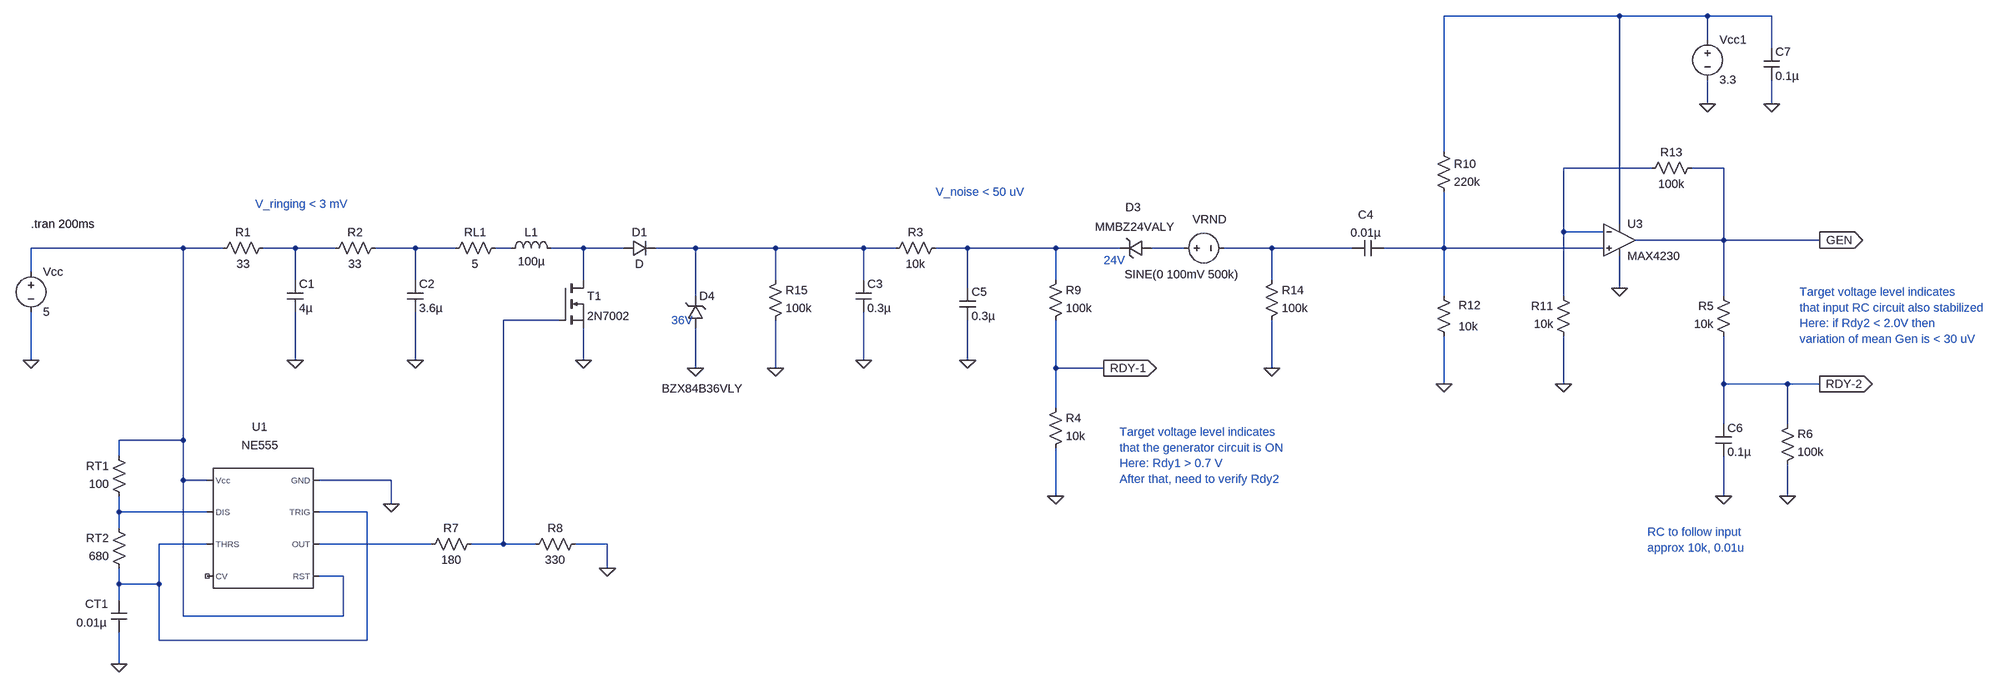
[diagram p0: schematic BoostPump10_WaveExtractor_red.asc]
BoostPump10_WaveExtractor_red.asc, the LTspice schematic file:
Version 4
SHEET 1 4340 772
WIRE 2576 -544 2160 -544
WIRE 2752 -544 2576 -544
WIRE 2880 -544 2752 -544
WIRE 2752 -496 2752 -544
WIRE 2880 -480 2880 -544
WIRE 2752 -368 2752 -416
WIRE 2880 -368 2880 -416
WIRE 2160 -272 2160 -544
WIRE 2640 -240 2464 -240
WIRE 2784 -240 2720 -240
WIRE 2576 -128 2576 -544
WIRE 2464 -112 2464 -240
WIRE 2544 -112 2464 -112
WIRE 2784 -96 2784 -240
WIRE 2784 -96 2608 -96
WIRE 2976 -96 2784 -96
WIRE -400 -80 -704 -80
WIRE -320 -80 -400 -80
WIRE -176 -80 -240 -80
WIRE -96 -80 -176 -80
WIRE 64 -80 -16 -80
WIRE 144 -80 64 -80
WIRE 256 -80 224 -80
WIRE 400 -80 336 -80
WIRE 480 -80 400 -80
WIRE 624 -80 544 -80
WIRE 784 -80 624 -80
WIRE 960 -80 784 -80
WIRE 1024 -80 960 -80
WIRE 1168 -80 1104 -80
WIRE 1344 -80 1168 -80
WIRE 1472 -80 1344 -80
WIRE 1600 -80 1536 -80
WIRE 1776 -80 1680 -80
WIRE 1936 -80 1776 -80
WIRE 2160 -80 2160 -192
WIRE 2160 -80 2000 -80
WIRE 2544 -80 2160 -80
WIRE -704 -32 -704 -80
WIRE -176 -16 -176 -80
WIRE 64 -16 64 -80
WIRE 400 -16 400 -80
WIRE 784 -16 784 -80
WIRE 960 -16 960 -80
WIRE 1344 -16 1344 -80
WIRE 1776 -16 1776 -80
WIRE 1168 0 1168 -80
WIRE 2576 0 2576 -64
WIRE 624 16 624 -80
WIRE 2160 16 2160 -80
WIRE 2464 16 2464 -112
WIRE 2784 16 2784 -96
WIRE 352 64 240 64
WIRE -704 144 -704 48
WIRE -176 144 -176 48
WIRE 64 144 64 48
WIRE 400 144 400 80
WIRE 960 144 960 48
WIRE 1168 144 1168 64
WIRE 624 160 624 80
WIRE 784 160 784 64
WIRE 1344 160 1344 64
WIRE 1440 160 1344 160
WIRE 1776 160 1776 64
WIRE 2160 192 2160 96
WIRE 2464 192 2464 96
WIRE 2784 192 2784 96
WIRE 2912 192 2784 192
WIRE 2976 192 2912 192
WIRE 1344 240 1344 160
WIRE 2784 272 2784 192
WIRE 2912 272 2912 192
WIRE -400 304 -400 -80
WIRE -400 304 -528 304
WIRE -528 336 -528 304
WIRE -400 384 -400 304
WIRE -352 384 -400 384
WIRE 16 384 -128 384
WIRE 1344 416 1344 320
WIRE 2784 416 2784 336
WIRE 2912 416 2912 352
WIRE 16 432 16 384
WIRE -528 448 -528 416
WIRE -352 448 -528 448
WIRE -32 448 -128 448
WIRE -528 480 -528 448
WIRE -352 512 -448 512
WIRE 96 512 -128 512
WIRE 240 512 240 64
WIRE 240 512 176 512
WIRE 304 512 240 512
WIRE 448 512 384 512
WIRE 448 560 448 512
WIRE -80 576 -128 576
WIRE -528 592 -528 560
WIRE -448 592 -448 512
WIRE -448 592 -528 592
WIRE -528 624 -528 592
WIRE -400 656 -400 384
WIRE -80 656 -80 576
WIRE -80 656 -400 656
WIRE -448 704 -448 592
WIRE -32 704 -32 448
WIRE -32 704 -448 704
WIRE -528 752 -528 688
FLAG 64 144 0
FLAG 400 144 0
FLAG 960 144 0
FLAG -704 144 0
FLAG 624 160 0
FLAG 1168 144 0
FLAG -176 144 0
FLAG -528 752 0
FLAG 16 432 0
FLAG 448 560 0
FLAG 2576 0 0
FLAG 2752 -368 0
FLAG 2880 -368 0
FLAG 2976 -96 GEN
IOPIN 2976 -96 Out
FLAG 1344 416 0
FLAG 1440 160 RDY-1
IOPIN 1440 160 Out
FLAG 2464 192 0
FLAG 2160 192 0
FLAG 2784 416 0
FLAG 784 160 0
FLAG 2912 416 0
FLAG 2976 192 RDY-2
IOPIN 2976 192 Out
FLAG 1776 160 0
SYMBOL res 0 -96 R90
WINDOW 0 0 56 VBottom 2
WINDOW 3 32 56 VTop 2
SYMATTR InstName R2
SYMATTR Value 33
SYMBOL res 240 -96 R90
WINDOW 0 0 56 VBottom 2
WINDOW 3 32 56 VTop 2
SYMATTR InstName RL1
SYMATTR Value 5
SYMBOL cap 48 -16 R0
SYMATTR InstName C2
SYMATTR Value 3.6µ
SYMBOL cap 944 -16 R0
SYMATTR InstName C3
SYMATTR Value 0.3µ
SYMBOL ind 240 -64 R270
WINDOW 0 32 56 VTop 2
WINDOW 3 5 56 VBottom 2
SYMATTR InstName L1
SYMATTR Value 100µ
SYMBOL diode 480 -64 R270
WINDOW 0 32 32 VTop 2
WINDOW 3 0 32 VBottom 2
SYMATTR InstName D1
SYMBOL nmos 352 -16 R0
SYMATTR InstName T1
SYMATTR Value 2N7002
SYMBOL voltage -704 -48 R0
WINDOW 123 0 0 Left 0
WINDOW 39 0 0 Left 0
SYMATTR InstName Vcc
SYMATTR Value 5
SYMBOL res 1120 -96 R90
WINDOW 0 0 56 VBottom 2
WINDOW 3 32 56 VTop 2
SYMATTR InstName R3
SYMATTR Value 10k
SYMBOL zener 1536 -96 R90
WINDOW 0 -50 37 VBottom 2
WINDOW 3 -42 34 VTop 2
SYMATTR InstName D3
SYMATTR Value MMBZ24VALY
SYMBOL cap -192 -16 R0
SYMATTR InstName C1
SYMATTR Value 4µ
SYMBOL res -224 -96 R90
WINDOW 0 0 56 VBottom 2
WINDOW 3 32 56 VTop 2
SYMATTR InstName R1
SYMATTR Value 33
SYMBOL Misc\\NE555 -240 480 M0
WINDOW 0 7 -202 Center 2
WINDOW 3 6 -166 Center 2
SYMATTR InstName U1
SYMBOL cap -544 624 R0
WINDOW 0 -52 8 Left 2
WINDOW 3 -69 45 Left 2
SYMATTR InstName CT1
SYMATTR Value 0.01µ
SYMBOL res -512 576 R180
WINDOW 0 36 76 Left 2
WINDOW 3 36 40 Left 2
SYMATTR InstName RT2
SYMATTR Value 680
SYMBOL res 192 496 R90
WINDOW 0 0 56 VBottom 2
WINDOW 3 32 56 VTop 2
SYMATTR InstName R7
SYMATTR Value 180
SYMBOL res 400 496 R90
WINDOW 0 0 56 VBottom 2
WINDOW 3 32 56 VTop 2
SYMATTR InstName R8
SYMATTR Value 330
SYMBOL res -512 432 R180
WINDOW 0 36 76 Left 2
WINDOW 3 36 40 Left 2
SYMATTR InstName RT1
SYMATTR Value 100
SYMBOL zener 608 80 M180
WINDOW 0 24 64 Left 2
WINDOW 3 -51 -121 Left 2
SYMATTR InstName D4
SYMATTR Value BZX84B36VLY
SYMBOL cap 1152 0 R0
SYMATTR InstName C5
SYMATTR Value 0.3µ
SYMBOL voltage 1584 -80 M90
WINDOW 123 0 0 Left 0
WINDOW 39 0 0 Left 0
WINDOW 0 -57 101 VLeft 2
WINDOW 3 53 126 VLeft 2
SYMATTR InstName VRND
SYMATTR Value SINE(0 100mV 500k)
SYMBOL cap 2000 -96 R90
WINDOW 0 -35 36 VBottom 2
WINDOW 3 -30 36 VTop 2
SYMATTR InstName C4
SYMATTR Value 0.01µ
SYMBOL OpAmps\\MAX4230 2576 -160 R0
SYMATTR InstName U3
SYMBOL res 2144 -288 R0
SYMATTR InstName R10
SYMATTR Value 220k
SYMBOL res 2480 112 R180
WINDOW 0 36 76 Left 2
WINDOW 3 36 40 Left 2
SYMATTR InstName R11
SYMATTR Value 10k
SYMBOL res 2176 112 R180
WINDOW 0 -58 78 Left 2
WINDOW 3 -52 35 Left 2
SYMATTR InstName R12
SYMATTR Value 10k
SYMBOL res 2736 -256 R90
WINDOW 0 0 56 VBottom 2
WINDOW 3 32 56 VTop 2
SYMATTR InstName R13
SYMATTR Value 100k
SYMBOL voltage 2752 -512 R0
WINDOW 123 0 0 Left 0
WINDOW 39 0 0 Left 0
SYMATTR InstName Vcc1
SYMATTR Value 3.3
SYMBOL cap 2864 -480 R0
SYMATTR InstName C7
SYMATTR Value 0.1µ
SYMBOL res 1760 80 M180
WINDOW 0 36 76 Left 2
WINDOW 3 36 40 Left 2
SYMATTR InstName R14
SYMATTR Value 100k
SYMBOL res 768 80 M180
WINDOW 0 36 76 Left 2
WINDOW 3 36 40 Left 2
SYMATTR InstName R15
SYMATTR Value 100k
SYMBOL res 1328 336 M180
WINDOW 0 36 76 Left 2
WINDOW 3 36 40 Left 2
SYMATTR InstName R4
SYMATTR Value 10k
SYMBOL res 2800 112 R180
WINDOW 0 36 76 Left 2
WINDOW 3 36 40 Left 2
SYMATTR InstName R5
SYMATTR Value 10k
SYMBOL cap 2768 272 R0
SYMATTR InstName C6
SYMATTR Value 0.1µ
SYMBOL res 2896 368 M180
WINDOW 0 36 76 Left 2
WINDOW 3 36 40 Left 2
SYMATTR InstName R6
SYMATTR Value 100k
SYMBOL res 1328 80 M180
WINDOW 0 36 76 Left 2
WINDOW 3 36 40 Left 2
SYMATTR InstName R9
SYMATTR Value 100k
TEXT -704 -128 Left 2 !.tran 200ms
TEXT -256 -168 Left 2 ;V_ringing < 3 mV
TEXT 1104 -192 Left 2 ;V_noise < 50 uV
TEXT 576 64 Left 2 ;36V
TEXT 1440 -56 Left 2 ;24V
TEXT 2632 488 Left 2 ;RC to follow input\napprox 10k, 0.01u
TEXT 2936 8 Left 2 ;Target voltage level indicates\nthat input RC circuit also stabilized\nHere: if Rdy2 < 2.0V then\nvariation of mean Gen is < 30 uV
TEXT 1472 288 Left 2 ;Target voltage level indicates\nthat the generator circuit is ON\nHere: Rdy1 > 0.7 V\nAfter that, need to verify Rdy2

The netlist it stands for:
* BoostPump10_WaveExtractor_red.asc
R2 N005 N004 33
RL1 N006 N005 5
C2 N005 0 3.6µ
C3 N008 0 0.3µ
L1 N006 N007 100µ
D1 N007 N008 D
M§T1 N007 N013 0 0 2N7002
Vcc N003 0 5
R3 N009 N008 10k
D3 N010 N009 MMBZ24VALY
C1 N004 0 4µ
R1 N004 N003 33
XU1 0 N015 N016 N003 NC_01 N015 N014 N003 NE555  ; pins GND TRIG OUT RST CV THRS DIS Vcc
CT1 N015 0 0.01µ
RT2 N015 N014 680
R7 N013 N016 180
R8 0 N013 330
RT1 N014 N003 100
D4 0 N008 BZX84B36VLY
C5 N009 0 0.3µ
VRND N010 N011 SINE(0 100mV 500k)
C4 N012 N011 0.01µ
XU3 N012 N002 N001 0 GEN MAX4230  ; pins In+ In- V+ V- OUT
R10 N001 N012 220k
R11 0 N002 10k
R12 0 N012 10k
R13 GEN N002 100k
Vcc1 N001 0 3.3
C7 N001 0 0.1µ
R14 0 N011 100k
R15 0 N008 100k
R4 0 RDY-1 10k
R5 RDY-2 GEN 10k
C6 RDY-2 0 0.1µ
R6 0 RDY-2 100k
R9 RDY-1 N009 100k
.model D D
.lib standard.dio
.model NMOS NMOS
.model PMOS PMOS
.lib standard.mos
.tran 200ms
* V_ringing < 3 mV
* V_noise < 50 uV
* 36V
* 24V
* RC to follow input
* approx 10k, 0.01u
* Target voltage level indicates
* that input RC circuit also stabilized
* Here: if Rdy2 < 2.0V then
* variation of mean Gen is < 30 uV
* Target voltage level indicates
* that the generator circuit is ON
* Here: Rdy1 > 0.7 V
* After that, need to verify Rdy2
.lib NE555.sub
.lib MAX4230.lib
.backanno
.end